# EAGLE design Qwiic-Cellular-Notepad (EAGLE 9.6.2)
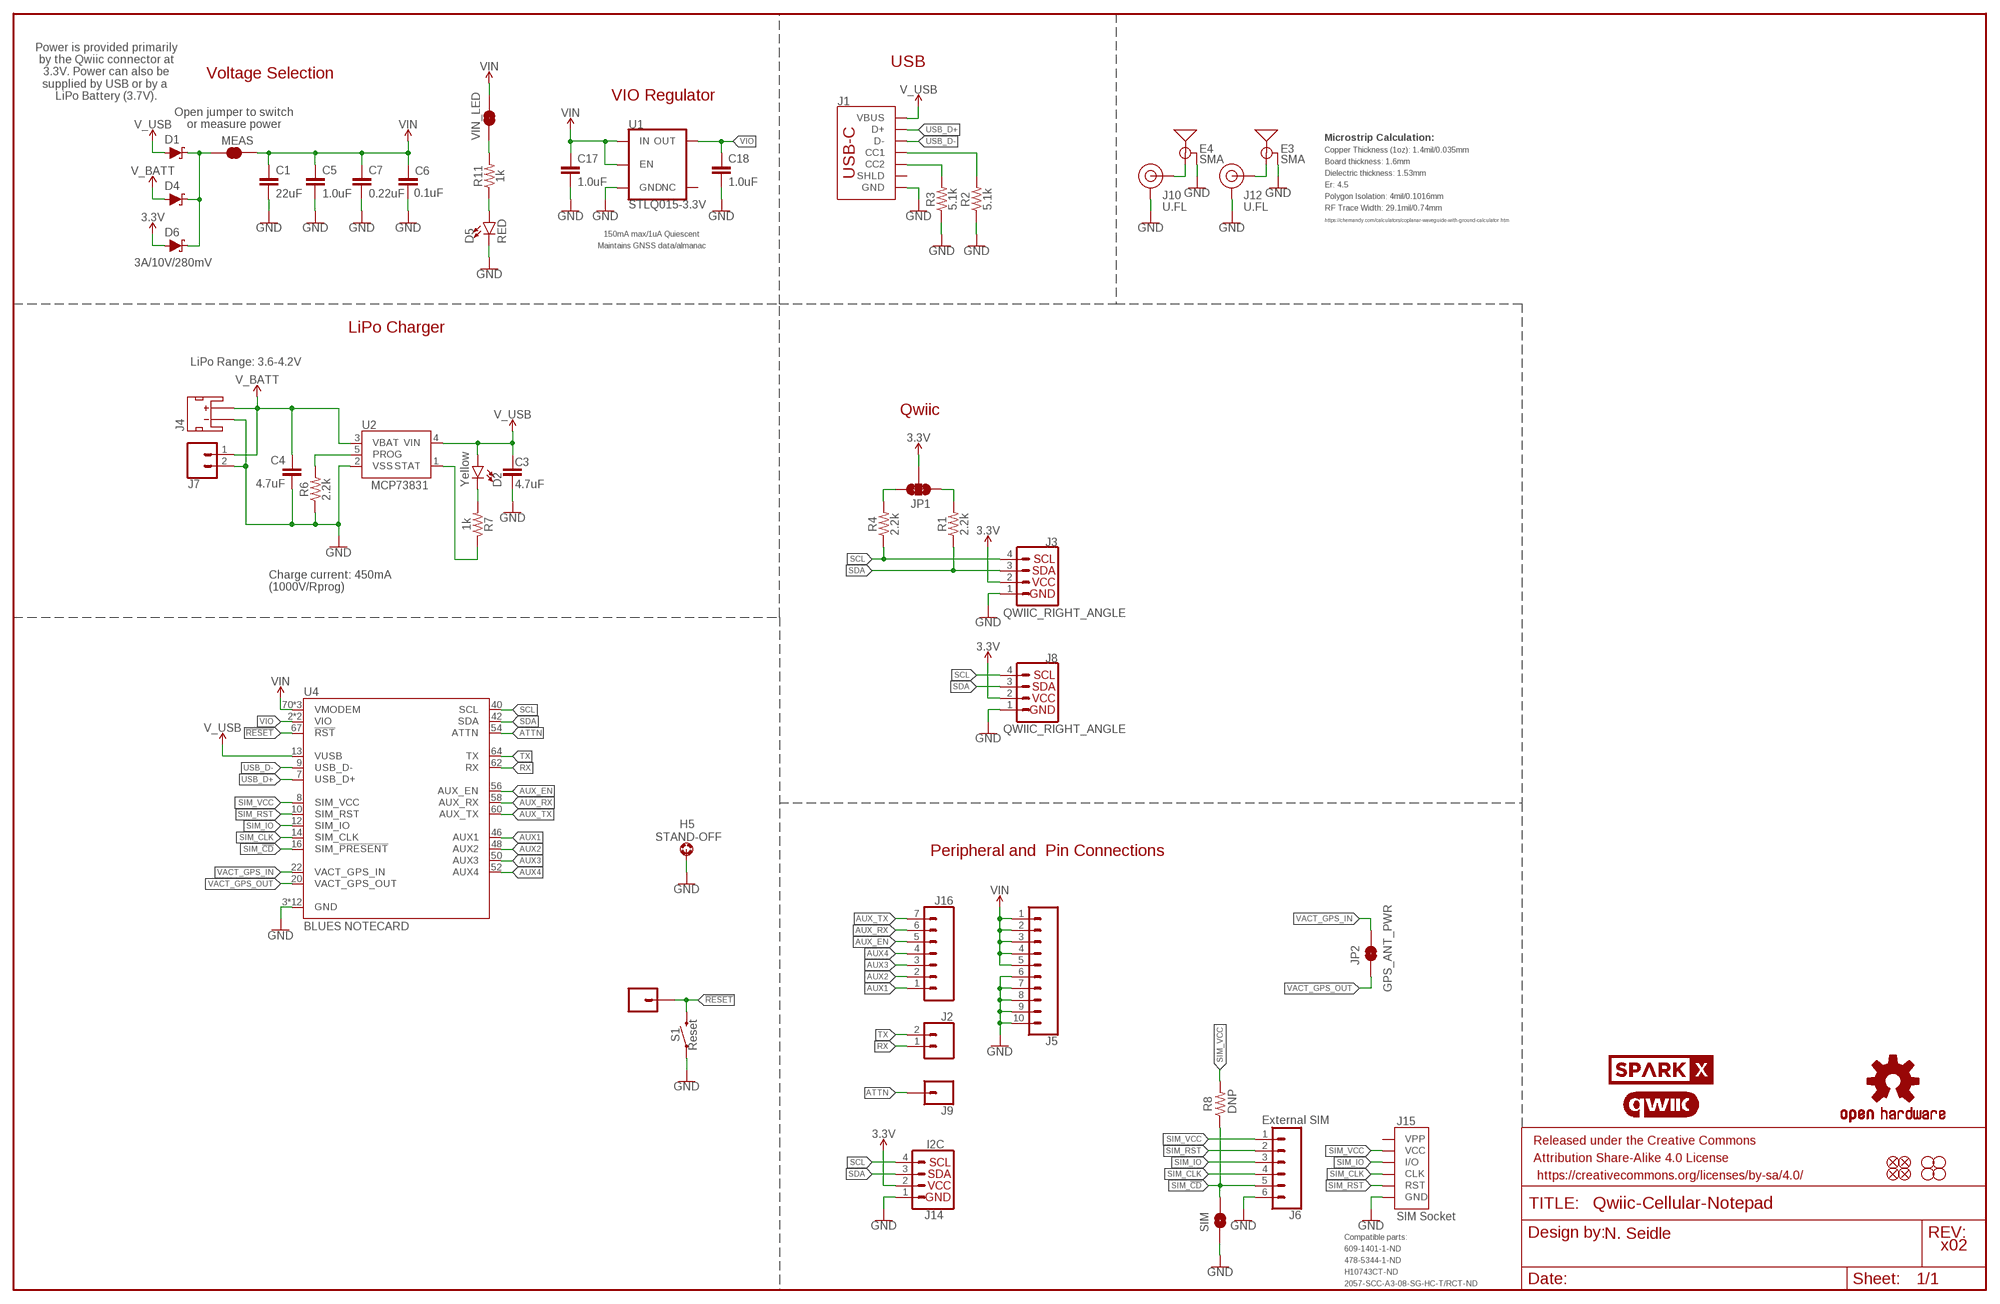
[diagram p0: schematic, sheet 1]

## Parts
C1  22uF  22UF-1210-16V-20%  [1210]
C3  4.7uF  4.7UF-0603-35V-(20%)  [0603]
C4  4.7uF  4.7UF-0603-6.3V-(10%)  [0603]
C5  1.0uF  1.0UF-0603-16V-10%  [0603]
C6  0.1uF  0.1UF-0603-25V-(+80/-20%)  [0603]
C7  0.22uF  0.22UF-0603-25V-10%  [0603]
C17  1.0uF  1.0UF-0603-16V-10%-X7R  [0603]
C18  1.0uF  1.0UF-0603-16V-10%-X7R  [0603]
D1  3A/10V/280mV  DIODE-SCHOTTKY-BAT60A  [SOD-323]
D2  Yellow  LED-YELLOW0603  [LED-0603]
D4  3A/10V/280mV  DIODE-SCHOTTKY-BAT60A  [SOD-323]
D5  RED  LED-RED0603  [LED-0603]
D6  3A/10V/280mV  DIODE-SCHOTTKY-BAT60A  [SOD-323]
E3  SMA  ANTENNA-SMA-GROUNDEDEDGE_SMA_SMD  [SMA-EDGE-SMD]
E4  SMA  ANTENNA-SMA-GROUNDEDEDGE_SMA_SMD  [SMA-EDGE-SMD]
FD1  FIDUCIALUFIDUCIAL  [FIDUCIAL-MICRO]
FD2  FIDUCIALUFIDUCIAL  [FIDUCIAL-MICRO]
FD3  FIDUCIALUFIDUCIAL  [FIDUCIAL-MICRO]
FD4  FIDUCIALUFIDUCIAL  [FIDUCIAL-MICRO]
FRAME1  FRAME-LEDGER  [CREATIVE_COMMONS]
H1  STAND-OFF  [STAND-OFF]
H2  STAND-OFF  [STAND-OFF]
H3  STAND-OFF  [STAND-OFF]
H4  STAND-OFF  [STAND-OFF]
H5  STAND-OFF  STAND-OFF-REFLOW2.5MM_TALL  [STAND-OFF-REFLOW-M2.5]
J1  USB_C_2-LAYER_PADS  [USB-C-16P-2LAYER-PADS]
J2  CONN_021X02_NO_SILK  [1X02_NO_SILK]
J3  QWIIC_RIGHT_ANGLE  QWIIC_CONNECTORJS-1MM  [JST04_1MM_RA]
J4  JST_2MM_MALE  [JST-2-SMD]
J5  CONN_10NO_SILK_PTH_FEMALE  [1X10_NO_SILK]
J6  External SIM  CONN_06NO_SILK_NO_POP  [1X06_NO_SILK]
J7  CONN_021X02_NO_SILK  [1X02_NO_SILK]
J8  QWIIC_RIGHT_ANGLE  QWIIC_CONNECTORJS-1MM  [JST04_1MM_RA]
J9  CONN_01PTH_NO_SILK_YES_STOP  [1X01_NO_SILK]
J10  U.FL  U.FL2PIN  [U.FL]
J12  U.FL  U.FL2PIN  [U.FL]
J13  CONN_01PTH_NO_SILK_YES_STOP  [1X01_NO_SILK]
J14  I2C  I2C_STANDARD_NO_SILK  [1X04_NO_SILK]
J15  SIM Socket  SIMHOLDER-SIM  [SIMHOLDER]
J16  CONN_07NO_SILK  [1X07_NO_SILK]
JP1  JUMPER-SMT_3_2-NC_TRACE_SILK  [SMT-JUMPER_3_2-NC_TRACE_SILK]
JP2  GPS_ANT_PWR  JUMPER-SMT_2_NO_SILK  [SMT-JUMPER_2_NO_SILK]
LOGO2  QWIIC_LOGO_CONNECTOR  [QWIIC_5.5MM]
LOGO3  OSHW-LOGOMINI  [OSHW-LOGO-MINI]
MEAS  JUMPER-COMBO_2_NC_TRACE  [COMBO-JUMPER_2_NC_TRACE]
R1  2.2k  2.2KOHM-0603-1/10W-1%  [0603]
R2  5.1k  5.1KOHM5.1KOHM-0603-1/10W-1%  [0603]
R3  5.1k  5.1KOHM5.1KOHM-0603-1/10W-1%  [0603]
R4  2.2k  2.2KOHM-0603-1/10W-1%  [0603]
R6  2.2k  2.2KOHM-0603-1/10W-1%  [0603]
R7  1k  1KOHM-0603-1/10W-1%  [0603]
R8  DNP  RESISTOR0603-RES  [0603-RES]
R11  1k  1KOHM-0603-1/10W-1%  [0603]
S1  Reset  MOMENTARY-SWITCH-SPST-SMD-5.2-TALL-REDUNDANT  [TACTILE_SWITCH_SMD_5.2MM]
SIM  JUMPER-SMT_2_NO_SILK  [SMT-JUMPER_2_NO_SILK]
U1  STLQ015-3.3V  [SOT23-5]
U2  MCP73831  [SOT23-5]
U4  BLUES NOTECARD  NOTECARD  [M.2-CONNECTOR-E]
U$56  SPARKX-LOGO4  [SPARKX-MEDIUM]
VIN_LED  JUMPER-SMT_2_NC_TRACE_SILK  [SMT-JUMPER_2_NC_TRACE_SILK]

## Nets
3.3V: D6.A J3.2 J8.2 J14.2 JP1.2
!RESET!: J13.1 S1.3 S1.4 U4.67(!RST!)
ATTN: J9.1 U4.54(ATTN)
AUX1: J16.1 U4.46(AUX1)
AUX2: J16.2 U4.48(AUX2)
AUX3: J16.3 U4.50(AUX3)
AUX4: J16.4 U4.52(AUX4)
AUX_EN: J16.5 U4.56(AUX_EN)
AUX_RX: J16.6 U4.58(AUX_RX)
AUX_TX: J16.7 U4.60(AUX_TX)
CHG_LED: R7.1 U2.1(STAT)
GND: C1.2 C3.2 C4.2 C5.2 C6.2 C7.2 C17.2 C18.2 D5.C E3.GND@0(GND) E3.GND@1(GND) E4.GND@0(GND) E4.GND@1(GND) H5.1 J1.GND J1.GND2(GND) J3.1 J4.1(-) J5.6 J5.7 J5.8 J5.9 J5.10 J6.6 J7.2 J8.1 J10.1(GND) J10.2(GND) J12.1(GND) J12.2(GND) J14.1 J15.C5(GND) R2.1 R3.1 R6.1 S1.1 S1.2 SIM.1 U1.2(GND) U2.2(VSS) U4.3(GND) U4.5(GND) U4.6(GND) U4.11(GND) U4.18(GND) U4.33(GND) U4.39(GND) U4.45(GND) U4.51(GND) U4.57(GND) U4.71(GND) U4.73(GND)
N$2: JP1.3 R4.2
N$3: JP1.1 R1.2
N$4: D2.C R7.2
N$5: D5.A R11.1
N$6: R11.2 VIN_LED.1
N$7: R6.2 U2.5(PROG)
N$10: J1.A5(CC1) R2.2
N$11: J1.B5(CC2) R3.2
RF_GPS: E4.SIG(SIGNAL) J10.FEED(SIGNAL)
RF_LTE: E3.SIG(SIGNAL) J12.FEED(SIGNAL)
RX: J2.1 U4.62(RX)
SCL: J3.4 J8.4 J14.4 R4.1 U4.40(SCL)
SDA: J3.3 J8.3 J14.3 R1.1 U4.42(SDA)
SIM_!CD!: J6.5 R8.1 SIM.2 U4.16(SIM_!PRESENT!)
SIM_CLK: J6.4 J15.C3(CLK) U4.14(SIM_CLK)
SIM_IO: J6.3 J15.C7(I/O) U4.12(SIM_IO)
SIM_RST: J6.2 J15.C2(RST) U4.10(SIM_RST)
SIM_VCC: J6.1 J15.C1(VCC) R8.2 U4.8(SIM_VCC)
TX: J2.2 U4.64(TX)
USB_D+: J1.A6(D+) J1.B6(D+) U4.7(USB_D+)
USB_D-: J1.A7(D-) J1.B7(D-) U4.9(USB_D-)
V_BATT: C4.1 D4.A J4.2(+) J7.1 U2.3(VBAT)
V_USB: C3.1 D1.A D2.A J1.VBUS1(VBUS) J1.VBUS2(VBUS) U2.4(VIN) U4.13(VUSB)
VACT_GPS_IN: JP2.2 U4.22(VACT_GPS_IN)
VACT_GPS_OUT: JP2.1 U4.20(VACT_GPS_OUT)
VIN: C1.1 C5.1 C6.1 C7.1 C17.1 J5.1 J5.2 J5.3 J5.4 J5.5 MEAS.2 MEAS.4 U1.1(IN) U1.3(EN) U4.70(VMODEM) U4.72(VMODEM) U4.74(VMODEM) VIN_LED.2
VIN1: D1.C D4.C D6.C MEAS.1 MEAS.3
VIO [power]: C18.1 U1.5(OUT) U4.2(VIO) U4.4(VIO)
Unconnected: J1.SHLD1(SHLD) J1.SHLD2(SHLD) J1.SHLD3(SHLD) J1.SHLD4(SHLD) J4.NC1(PAD1) J4.NC2(PAD2) J15.C6(VPP) U1.4(NC)

## Notes on the sheet
- USB
- Power is provided primarily
  by the Qwiic connector at
  3.3V. Power can also be
  supplied by USB or by a 
  LiPo Battery (3.7V).
- Voltage Selection
- VIO Regulator
- Open jumper to switch
  or measure power
- Microstrip Calculation:
- Copper Thickness (1oz): 1.4mil/0.035mm
- Board thickness: 1.6mm
- Dielectric thickness: 1.53mm
- Er: 4.5
- Polygon Isolation: 4mil/0.1016mm
- RF Trace Width: 29.1mil/0.74mm
- https://chemandy.com/calculators/coplanar-waveguide-with-ground-calculator.htm
- 150mA max/1uA Quiescent
- Maintains GNSS data/almanac
- LiPo Charger
- LiPo Range: 3.6-4.2V
- Qwiic
- Charge current: 450mA
  (1000V/Rprog)
- Peripheral and  Pin Connections
- Compatible parts: | N. Seidle
- 609-1401-1-ND | x02
- 478-5344-1-ND
- H10743CT-ND
- 2057-SCC-A3-08-SG-HC-T/RCT-ND

## Library data of the parts
C1 = SparkFun-Capacitors:22UF: 22µF ceramic capacitors A capacitor is a passive two-terminal electrical component used to store electrical energy temporarily in an electric field.; PROD_ID: CAP-10381
C3 = SparkFun-Capacitors:4.7UF: 4.7µF ceramic capacitors A capacitor is a passive two-terminal electrical component used to store electrical energy temporarily in an electric field.; PROD_ID: CAP-14106
C4 = SparkFun-Capacitors:4.7UF: 4.7µF ceramic capacitors A capacitor is a passive two-terminal electrical component used to store electrical energy temporarily in an electric field.; PROD_ID: CAP-08280
C5 = SparkFun-Capacitors:1.0UF: 1µF ceramic capacitors A capacitor is a passive two-terminal electrical component used to store electrical energy temporarily in an electric field.; PROD_ID: CAP-00868
C6 = SparkFun-Capacitors:0.1UF: 0.1µF ceramic capacitors A capacitor is a passive two-terminal electrical component used to store electrical energy temporarily in an electric field.; PROD_ID: CAP-00810
C7 = SparkFun-Capacitors:0.22UF: 0.22µF ceramic capacitors A capacitor is a passive two-terminal electrical component used to store electrical energy temporarily in an electric field.; PROD_ID: CAP-07822
C17 C18 = SparkFun-Capacitors:1.0UF: 1µF ceramic capacitors A capacitor is a passive two-terminal electrical component used to store electrical energy temporarily in an electric field.; PROD_ID: CAP-13930
D1 D4 D6 = SparkFun-DiscreteSemi:DIODE-SCHOTTKY: Schottky diode A Schottky diode is a semiconductor diode which has a low forward voltage drop and a very fast switching action.; PROD_ID: DIO-14072
D2 = SparkFun-LED:LED-YELLOW: Yellow SMD LED Used in manufacturing several products at SparkFun. Packages: 0603 - SMD 0603 package[Product Link] <http://www.kingbrightusa.com/product.asp?catalog_name=LED&product_id=APT1608SYCK> 0603 -SMART - SMART SMD 0603 package (more efficient/more expensive) [Product Link] <http://www.osram-os.com/osram_os/en/products/product-catalog/led-light-emitting-diodes/smartled-0603/ly-l29k/index.jsp> LilyPad - SMD1206 package[Product Datasheet] <https://www.sparkfun.com/datasheets/DevTools/LilyPad/Q150YUS4.pdf> SparkFun Products: Blynk Board <https://www.sparkfun.com/products/13794> IOIO-OTG <https://www.sparkfun.com/products/13613> XBee Explorer Serial <https://www.sparkfun.com/products/13225>; PROD_ID: DIO-09003
D5 = SparkFun-LED:LED-RED: Red SMD LED Used in manufacturing of most products at SparkFun Packages: 0603 - SMD 0603 package [Product Link] <http://docs.avagotech.com/docs/AV02-0551EN> 0603 SMART - SMD 0603 SMART package ( more efficient and expensive)[Product Link] <http://www.osram-os.com/Graphics/XPic2/00077099_0.pdf> 1206 - SMD1206 package [Product Link] <https://www.sparkfun.com/datasheets/DevTools/LilyPad/Q150OVS4.pdff> SparkFun Products: Pro Mini 328 -5V <https://www.sparkfun.com/products/821> RedBoard <https://www.sparkfun.com/products/12757> IOIO-OTG <https://www.sparkfun.com/products/13613>; PROD_ID: DIO-00819
E3 E4 = SparkFun-RF:ANTENNA-SMA-GROUNDED: SMA Antenna Connector w/ Ground Edge-mount and SMD SMA connectors for RF Antennas. **4-LAYER BOARD WARNING!!** When designing a 4-layer board using any of the SMD variants, you will need to manually add a cutout polygon on any internal power layers to make sure that you don't end up with exposed copper around the edge of the routed hole for these connectors. Exposed power copper could then short to the connector body - and that would be bad. Why hasn't anyone added the cutout polygons directly to the connector footprint? Well, your internal layers (usually 2 and 15) may be covered with GND polygons and you might well want the copper to go all the way to the edge, especially under the connector SIGNAL pin. So adding cutouts to the footprint might make matters worse, not better...; PROD_ID: CONN-15100
FD1-FD4 = SparkFun-Aesthetics:FIDUCIAL: Fiducial Alignment Points Point-of-reference for pick-and-place machines and other optical instruments.
FRAME1 = SparkFun-Aesthetics:FRAME-LEDGER: Schematic Frame - Ledger Standard 11x14 US Ledger frame
H1-H4 = SparkFun-Hardware:STAND-OFF: Stand Off Drill holes for mechanically mounting via screws, standoffs, etc. Note: Use the keepout ring to avoid running the screw head into surrounding components. Variant Overviews STAND-OFF - Mechanical footprint for a #4 phillips button head screw. STAND-OFF-TIGHT - Mechanical footprint for a #4 phillips button head screw, Example SparkFun Products Screw - Phillips Head (1/4", 4-40, 10 pack) <https://www.sparkfun.com/products/10453> (PRT-10453) Screw - Phillips Head (1/2", 4-40, 10 pack) <https://www.sparkfun.com/products/10452> (PRT-10452) Screw - Phillips Head (3/4", 4-40, 10 pack) <https://www.sparkfun.com/products/10451> (PRT-10451) Screw - Phillips Head (1", 4-40, 10 pack) <https://www.sparkfun.com/products/10450> (PRT-10450)
H5 = SparkFun-Hardware:STAND-OFF-REFLOW: Stand Off Reflow Compatible A metal standoff that can be placed and reflowed onto a PCB.; PROD_ID: HW-14899
J1 = SparkFun-Connectors:USB_C: USB Type C 16Pin Connector Super Speed pins not available on the 16-pin purely SMD connector so this part is best for USB 2.0 implementations. D1 and D2 are tied together enabling D+/- no matter which way the cable is plugged into the connector. The two channel configuration pins (CC1/2) are exposed. These are normally connected to ground via 5.1k resistors but can be reconfigured for high current/high power applications. **4-LAYER BOARD WARNING!!** If designing 4-layer board, make sure to select the variant _4-LAYER-ISOLATED. The linked footprint (USB-C-16-4LAYER-ISOLATED) includes some very necessary cutout polygons in the inner layers (2 and 15). This prevents the PTH mounting shield legs on the USB connector from electrically connecting any other polygons on the inner layers (usually VCC and GND).; PROD_ID: CONN-14122
J2 J7 = SparkFun-Connectors:CONN_02: Multi connection point. Often used as Generic Header-pin footprint for 0.1 inch spaced/style header connections On any of the 0.1 inch spaced packages, you can populate with these: Break Away Headers - Straight <https://www.sparkfun.com/products/116> (PRT-00116) Break Away Male Headers - Right Angle <https://www.sparkfun.com/products/553> (PRT-00553) Female Headers <https://www.sparkfun.com/products/115> (PRT-00115) Break Away Headers - Machine Pin <https://www.sparkfun.com/products/117> (PRT-00117) Break Away Female Headers - Swiss Machine Pin <https://www.sparkfun.com/products/743> (PRT-00743) For SCREWTERMINALS and SPRING TERMINALS visit here: Screw Terimnals on SparkFun.com <https://www.sparkfun.com/search/results?term=Screw+Terminals> (5mm/3.5mm/2.54mm spacing) This device is also useful as a general connection point to wire up your design to another part of your project. Our various solder wires solder well into these plated through hole pads. Hook-Up Wire - Assortment (Stranded, 22 AWG) <https://www.sparkfun.com/products/11375> (PRT-11375) Hook-Up Wire - Assortment (Solid Core, 22 AWG) <https://www.sparkfun.com/products/11367> (PRT-11367) View the entire wire category on our website here <https://www.sparkfun.com/categories/141> Special notes: Molex polarized connector foot print use with: PRT-08233 with associated crimp pins and housings. 2.54_SCREWTERM for use with PRT-10571. 3.5mm Screw Terminal footprints for PRT-08084 5mm Screw Terminal footprints for use with PRT-08432
J3 J8 = SparkFun-Connectors:QWIIC_CONNECTOR: SparkFun I2C Standard Qwiic Connector An SMD 1mm pitch JST connector makes it easy and quick (get it? Qwiic?) to connect I2C devices to each other. The Qwiic system <http://www.sparkfun.com/qwiic> enables fast and solderless connection between popular platforms and various sensors and actuators. We carry 200mm <https://www.sparkfun.com/products/14204>, 100mm <https://www.sparkfun.com/products/14205>, 50mm <https://www.sparkfun.com/products/14206>, and breadboard friendly <https://www.sparkfun.com/products/14207> Qwiic cables. We also offer 10 pcs strips <https://www.sparkfun.com/products/14323> the SMD connectors.; PROD_ID: CONN-13694
J4 = SparkFun-Connectors:JST_2MM_MALE: JST 2MM MALE RA CONNECTOR Two pin, compact surface mount connector. Commonly used as a battery input connection point. We really like the solid locking feeling and high current rating on these small connectors. We use these all the time as battery connectors. Mates to single-cell LiPo batteries. Here is the connector we sell at SparkFun: JST Right Angle Connector - White <https://www.sparkfun.com/products/8612> (PRT-08612) Datasheet <http://www.sparkfun.com/datasheets/Prototyping/Connectors/JST-Horizontal.pdf> It was used on these SparkFun products: SparkFun MOSFET Power Controller <https://www.sparkfun.com/products/11214> (PRT-11214) SparkFun Battery Babysitter - LiPo Battery Manager <https://www.sparkfun.com/products/13777> (PRT-13777) And many, many others that required a lipo battery connection.; PROD_ID: CONN-11443; SF_ID: PRT-08612
J5 = SparkFun-Connectors:CONN_10: Multi connection point. Often used as Generic Header-pin footprint for 0.1 inch spaced/style header connections On any of the 0.1 inch spaced packages, you can populate with these: Break Away Headers - Straight <https://www.sparkfun.com/products/116> (PRT-00116) Break Away Male Headers - Right Angle <https://www.sparkfun.com/products/553> (PRT-00553) Female Headers <https://www.sparkfun.com/products/115> (PRT-00115) Break Away Headers - Machine Pin <https://www.sparkfun.com/products/117> (PRT-00117) Break Away Female Headers - Swiss Machine Pin <https://www.sparkfun.com/products/743> (PRT-00743) Arduino Stackable Header - 10 Pin <https://www.sparkfun.com/products/11376> (PRT-11376) For SCREWTERMINALS and SPRING TERMINALS visit here: Screw Terimnals on SparkFun.com <https://www.sparkfun.com/search/results?term=Screw+Terminals> (5mm/3.5mm/2.54mm spacing) This device is also useful as a general connection point to wire up your design to another part of your project. Our various solder wires solder well into these plated through hole pads. Hook-Up Wire - Assortment (Stranded, 22 AWG) <https://www.sparkfun.com/products/11375> (PRT-11375) Hook-Up Wire - Assortment (Solid Core, 22 AWG) <https://www.sparkfun.com/products/11367> (PRT-11367) View the entire wire category on our website here <https://www.sparkfun.com/categories/141> Special notes: Molex polarized connector foot print use with SKU : PRT-08231 with associated crimp pins and housings. 1MM SMD Version SKU: PRT-10208 NOTES ON THE VARIANTS LOCK and LOCK_LONGPADS... This footprint was designed to help hold the alignment of a through-hole component (i.e. 6-pin header) while soldering it into place. You may notice that each hole has been shifted either up or down by 0.005 of an inch from it's more standard position (which is a perfectly straight line). This slight alteration caused the pins (the squares in the middle) to touch the edges of the holes. Because they are alternating, it causes a "brace" to hold the component in place. 0.005 has proven to be the perfect amount of "off-center" position when using our standard breakaway headers. Although looks a little odd when you look at the bare footprint, once you have a header in there, the alteration is very hard to notice. Also,if you push a header all the way into place, it is covered up entirely on the bottom side.
J6 = SparkFun-Connectors:CONN_06: Multi connection point. Often used as Generic Header-pin footprint for 0.1 inch spaced/style header connections On any of the 0.1 inch spaced packages, you can populate with these: Break Away Headers - Straight <https://www.sparkfun.com/products/116> (PRT-00116) Break Away Male Headers - Right Angle <https://www.sparkfun.com/products/553> (PRT-00553) Female Headers <https://www.sparkfun.com/products/115> (PRT-00115) Break Away Headers - Machine Pin <https://www.sparkfun.com/products/117> (PRT-00117) Break Away Female Headers - Swiss Machine Pin <https://www.sparkfun.com/products/743> (PRT-00743) Arduino Stackable Header - 6 Pin <https://www.sparkfun.com/products/9280> (PRT-09280) For SCREWTERMINALS and SPRING TERMINALS visit here: Screw Terimnals on SparkFun.com <https://www.sparkfun.com/search/results?term=Screw+Terminals> (5mm/3.5mm/2.54mm spacing) This device is also useful as a general connection point to wire up your design to another part of your project. Our various solder wires solder well into these plated through hole pads. Hook-Up Wire - Assortment (Stranded, 22 AWG) <https://www.sparkfun.com/products/11375> (PRT-11375) Hook-Up Wire - Assortment (Solid Core, 22 AWG) <https://www.sparkfun.com/products/11367> (PRT-11367) View the entire wire category on our website here <https://www.sparkfun.com/categories/141>
J9 J13 = SparkFun-Connectors:CONN_01: Single connection point. Often used as Generic Header-pin footprint for 0.1 inch spaced/style header connections On any of the 0.1 inch spaced packages, you can populate with these: Break Away Headers - Straight <https://www.sparkfun.com/products/116> (PRT-00116) Break Away Male Headers - Right Angle <https://www.sparkfun.com/products/553> (PRT-00553) Female Headers <https://www.sparkfun.com/products/115> (PRT-00115) Break Away Headers - Machine Pin <https://www.sparkfun.com/products/117> (PRT-00117) Break Away Female Headers - Swiss Machine Pin <https://www.sparkfun.com/products/743> (PRT-00743) This device is also useful as a general connection point to wire up your design to another part of your project. Our various solder wires solder well into these plated through hole pads. Hook-Up Wire - Assortment (Stranded, 22 AWG) <https://www.sparkfun.com/products/11375> (PRT-11375) Hook-Up Wire - Assortment (Solid Core, 22 AWG) <https://www.sparkfun.com/products/11367> (PRT-11367) View the entire wire category on our website here <https://www.sparkfun.com/categories/141> Special notes: SMTSO-256-ET is a "flush mount" nut for a 4-40 screw. We mostly use this on specialty testbeds; it is a nice way to connect hardware to your PCB at an adjustable hieght. Also note, the SNAP packages are for using a snappable style connector. We sell a baggie of snaps and they are also used on two LilyPad designs: Snap Assortment - 30 pack (male and female) <https://www.sparkfun.com/products/11347> (DEV-11347) LilyPad Arduino SimpleSnap <https://www.sparkfun.com/products/10941> (DEV-10941) LilyPad SimpleSnap Protoboard <https://www.sparkfun.com/products/10940> (DEV-10940)
J10 J12 = SparkFun-Connectors:U.FL2PIN: SMD Antenna Connector - U.FL 2mm height, 3.0mm x 3.0mm receptacle size. SparkFun Products: SparkFun WiFi Shield - ESP8266 <https://www.sparkfun.com/products/13287> SparkFun ESP8266 Thing <https://www.sparkfun.com/products/13231> SparkFun MiniGen - Pro Mini Signal Generator Shield <https://www.sparkfun.com/products/11420>; PROD_ID: CONN-09193; SF_ID: WRL-09144
J14 = SparkFun-Connectors:I2C_STANDARD: SparkFun I2C Standard Pinout Header SparkFun has standardized on a pinout for all I2C based sensor breakouts. This pinout allows I2C boards to be plugged directly into the headers on Arduino Uno compatible boards, and to be daisy chained easily. Example SparkFun Products: SparkFun Atmospheric Sensor Breakout - BME280 <https://www.sparkfun.com/products/13676> SparkFun Altitude/Pressure Sensor Breakout - MPL3115A2 <https://www.sparkfun.com/products/11084> SparkFun TOF Range Finder Sensor - VL6180 <https://www.sparkfun.com/products/12785>
J15 = SparkFun-Connectors:SIMHOLDER: SIM Cellular Card Socket SMT 6 pin standard connection. SparkFun Products: SIM Socket <https://www.sparkfun.com/products/548> SparkFun Cellular Shield - MG2639 <https://www.sparkfun.com/products/13120> SparkFun SIM Card Socket Breakout <https://www.sparkfun.com/products/573>; PROD_ID: CONN-08536; SF_ID: PRT-00548
J16 = SparkFun-Connectors:CONN_07: Multi connection point. Often used as Generic Header-pin footprint for 0.1 inch spaced/style header connections On any of the 0.1 inch spaced packages, you can populate with these: Break Away Headers - Straight <https://www.sparkfun.com/products/116> (PRT-00116) Break Away Male Headers - Right Angle <https://www.sparkfun.com/products/553> (PRT-00553) Female Headers <https://www.sparkfun.com/products/115> (PRT-00115) Break Away Headers - Machine Pin <https://www.sparkfun.com/products/117> (PRT-00117) Break Away Female Headers - Swiss Machine Pin <https://www.sparkfun.com/products/743> (PRT-00743) For SCREWTERMINALS and SPRING TERMINALS visit here: Screw Terimnals on SparkFun.com <https://www.sparkfun.com/search/results?term=Screw+Terminals> (5mm/3.5mm/2.54mm spacing) This device is also useful as a general connection point to wire up your design to another part of your project. Our various solder wires solder well into these plated through hole pads. Hook-Up Wire - Assortment (Stranded, 22 AWG) <https://www.sparkfun.com/products/11375> (PRT-11375) Hook-Up Wire - Assortment (Solid Core, 22 AWG) <https://www.sparkfun.com/products/11367> (PRT-11367) View the entire wire category on our website here <https://www.sparkfun.com/categories/141> Special notes: Molex polarized connector foot print use with SKU : PRT-08231 with associated crimp pins and housings. 1MM SMD Version SKU: PRT-10208 NOTES ON THE VARIANTS LOCK and LOCK_LONGPADS... This footprint was designed to help hold the alignment of a through-hole component (i.e. 6-pin header) while soldering it into place. You may notice that each hole has been shifted either up or down by 0.005 of an inch from it's more standard position (which is a perfectly straight line). This slight alteration caused the pins (the squares in the middle) to touch the edges of the holes. Because they are alternating, it causes a "brace" to hold the component in place. 0.005 has proven to be the perfect amount of "off-center" position when using our standard breakaway headers. Although looks a little odd when you look at the bare footprint, once you have a header in there, the alteration is very hard to notice. Also,if you push a header all the way into place, it is covered up entirely on the bottom side.
JP1 = SparkFun-Jumpers:JUMPER-SMT_3_2-NC_TRACE: Normally closed trace jumper (2 of 2 connections) This jumper has a trace between all three pads so they are normally closed (NC). Use a razor knife to open the connection(s). For best results follow the IPC guidelines for cutting traces: Cutout at least 0.063 mm (0.005 in). Remove all loose material to clean up the cut area. Seal the cut with an approved epoxy. Reapply solder to reclose the connection(s).
JP2 SIM = SparkFun-Jumpers:JUMPER-SMT_2_NO: Normally open jumper This jumper has two pads in close proximity to each other. Apply solder to close the connection. Round pads are easier to solder for beginners, but are a lot larger. SparkFun Product that uses the round pads: SparkFun EL Sequencer <https://www.sparkfun.com/products/12781>
LOGO2 = SparkFun-Aesthetics:QWIIC_LOGO: Qwiic Logos for placement on schematic and PCB. The 5.5mm silk logo is best for placing next to Qwiic connector.
LOGO3 = SparkFun-Aesthetics:OSHW-LOGO: Open-Source Hardware (OSHW) Logo This logo indicates the piece of hardware it is found on incorporates a OSHW license and/or adheres to the definition of open source hardware found here: http://freedomdefined.org/OSHW
MEAS = SparkFun-Jumpers:JUMPER-COMBO_2_NC_TRACE
R1 R4 R6 = SparkFun-Resistors:2.2KOHM: 2.2kΩ resistor A resistor is a passive two-terminal electrical component that implements electrical resistance as a circuit element. Resistors act to reduce current flow, and, at the same time, act to lower voltage levels within circuits. - Wikipedia; PROD_ID: RES-08272
R2 R3 = SparkFun-Resistors:5.1KOHM; PROD_ID: RES-12083
R7 R11 = SparkFun-Resistors:1KOHM: 1kΩ resistor A resistor is a passive two-terminal electrical component that implements electrical resistance as a circuit element. Resistors act to reduce current flow, and, at the same time, act to lower voltage levels within circuits. - Wikipedia; PROD_ID: RES-07856
R8 = Testing:RESISTOR: Resistor Basic schematic elements and footprints for 0603, 1206, and PTH resistors.
S1 = SparkFun-Switches:MOMENTARY-SWITCH-SPST: Momentary Switch (Pushbutton) - SPST Normally-open (NO) SPST momentary switches (buttons, pushbuttons). Variants PTH-12MM - 12mm square, through-hole Momentary Pushbutton Switch - 12mm Square <https://www.sparkfun.com/products/9190> (COM-09190) PTH-6.0MM, PTH-6.0MM-KIT - 6.0mm square, through-hole Mini Pushbutton Switch <https://www.sparkfun.com/products/97> (COM-00097) KIT package intended for soldering kit's - only one side of pads' copper is exposed. PTH-RIGHT-ANGLE-KIT - Right-angle, through-hole Right Angle Tactile Button <https://www.sparkfun.com/products/10791> - Used on SparkFun BigTime Watch Kit <https://www.sparkfun.com/products/11734> SMD-12MM - 12mm square, surface-mount Tactile Button - SMD (12mm) <https://www.sparkfun.com/products/12993> (COM-12993) Used on SparkFun PicoBoard <https://www.sparkfun.com/products/11888> SMD-4.5MM - 4.5mm Square Trackball Switch Used on SparkFun Blackberry Trackballer Breakout <https://www.sparkfun.com/products/13169> SMD-4.6MMX2.8MM - 4.60mm x 2.80mm, surface mount Used on SparkFun Pro Micro - RP2040 <https://www.sparkfun.com/products/17717> SMD-5.2MM, SMD-5.2-REDUNDANT - 5.2mm square, surface-mount Mini Pushbutton Switch - SMD <https://www.sparkfun.com/products/8720> (COM-08720) Used on Arduino Pro Mini <https://www.sparkfun.com/products/11114> REDUNDANT package connects both switch circuits together SMD-6.0X3.5MM - 6.0 x 3.5mm, surface mount Momentary Reset Switch SMD <https://www.sparkfun.com/products/8229> (COM-08229) SMD-6.2MM-TALL - 6.2mm square, surface mount Tactile Button - SMD (6mm) <https://www.sparkfun.com/products/12992> Used on SparkFun Digital Sandbox <https://www.sparkfun.com/products/12651> SMD-RIGHT-ANGLE - Right-angle, surface mount Used on SparkFun Block for Intel® Edison - Arduino <https://www.sparkfun.com/products/13036>; PROD_ID: SWCH-14139
U1 = SparkFun-IC-Power:STLQ015: STLQ015 - 150mA CMOS LDO Regulator w/ Enable 1.4uA quiescent; PROD_ID: IC-15779
U2 = SparkFun-IC-Power:MCP73831: MCP73831T Li-Ion, Li-Pol Controller Miniature single cell, fully integrated Li-Ion, Li-polymer charge management controller Datasheet <http://ww1.microchip.com/downloads/en/DeviceDoc/20001984g.pdf> SparkFun Products: SparkFun ESP32 Thing <https://www.sparkfun.com/products/13907> SparkFun 9DoF Razor IMU M0 <https://www.sparkfun.com/products/14001>; PROD_ID: IC-09995
U4 = Notecard:NOTECARD
U$56 = SparkX:SPARKX-LOGO
VIN_LED = SparkFun-Jumpers:JUMPER-SMT_2_NC_TRACE: Normally closed trace jumper This jumper has a trace between two pads so it's normally closed (NC). Use a razor knife to open the connection. For best results follow the IPC guidelines for cutting traces: Cutout at least 0.063 mm (0.005 in). Remove all loose material to clean up the cut area. Seal the cut with an approved epoxy. Reapply solder to reclose the connection.

## Net classes
1 power: width 0.305 mm

## Board
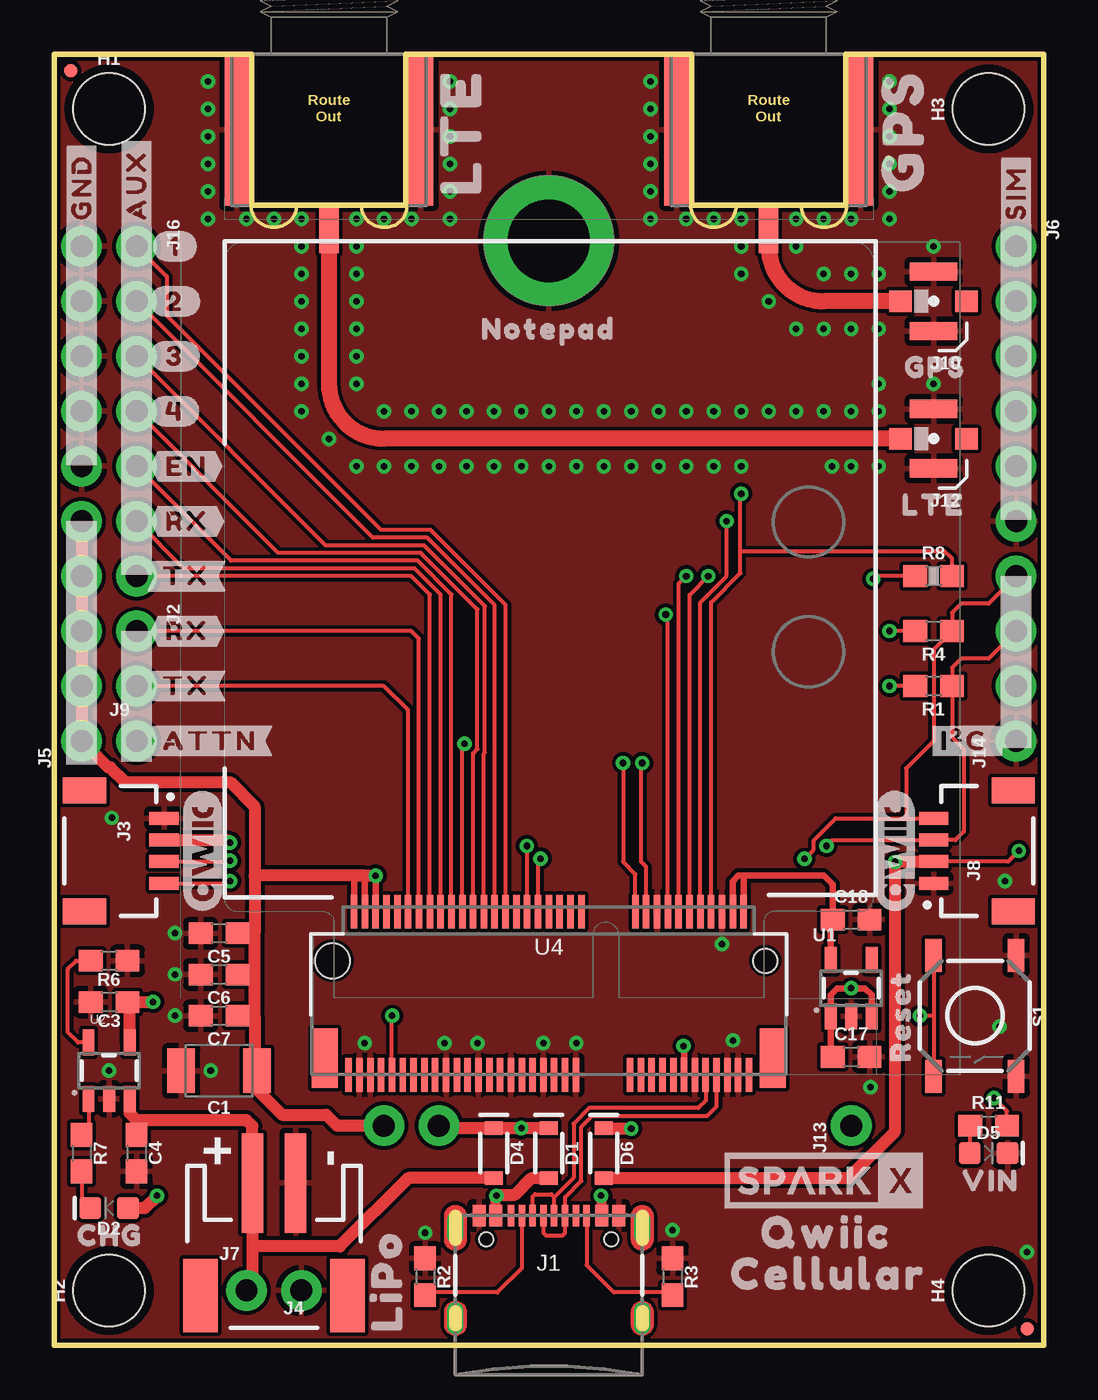
[diagram p1: board, top side]
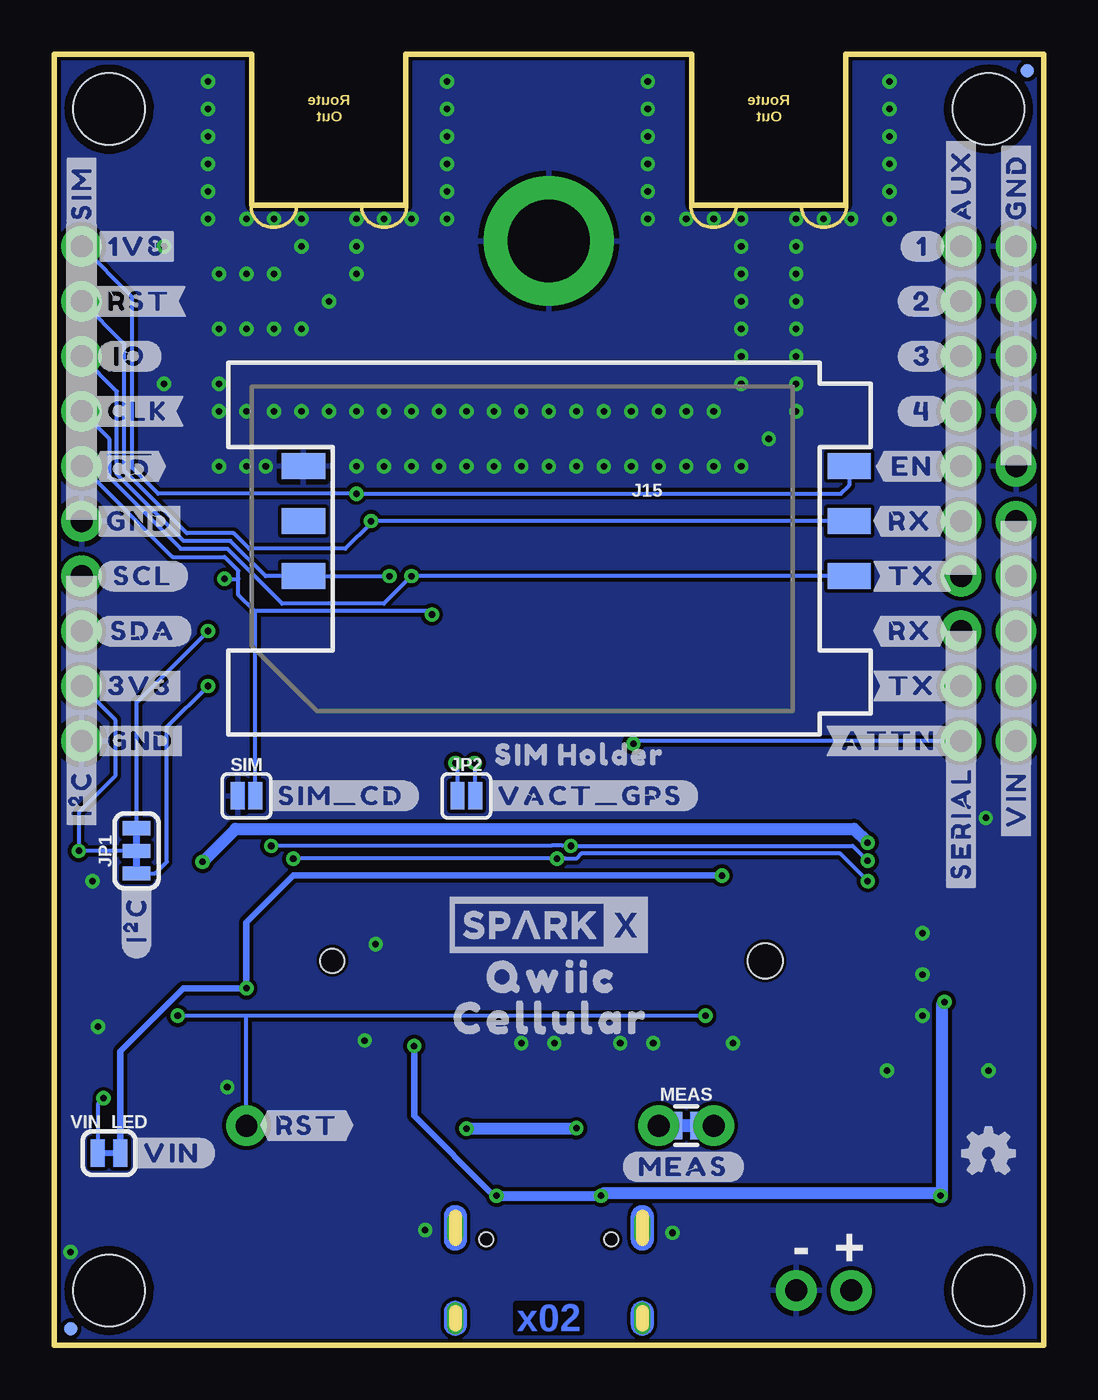
[diagram p2: board, bottom side, seen from below]

Size 45.72 x 59.69 mm. Coordinates in mm from the lower left corner, seen from the top.
Outline: 45.72,0 0,0 0,59.69 9.14,59.69 9.14,52.7 16.26,52.7 16.26,59.69 29.46,59.69 29.46,52.7 36.58,52.7 36.58,59.69 45.72,59.69 45.72,0
Copper layers (1*16): Top 0.035mm / dielectric 1.5mm / Bottom 0.035mm
Design rules "SparkFun-2-layer-TIGHT *": minimum track width 7mil, minimum drill 12mil, track to track 7mil, track to pad 7mil, pad to pad 7mil, via to via 7mil, smd to smd 7mil, copper to edge 7mil, drill to drill 7mil, minimum pad ring 7mil, minimum via ring 7mil, stop-mask expansion 4mil, vias tented up to drill 25mil, thermal gap 10mil

### Footprints (pad centres in the part's own frame; a part is rotated, then mirrored left to right if it is on the bottom)
1210 = smd 1.27 x 2.06: 1 -1.755,0; 2 1.755,0
0603 = smd 1.1 x 1: 1 -0.85,0; 2 0.85,0
SOD-323 = smd 0.63 x 0.83: A 1.15,0; C -1.15,0
LED-0603 = smd 1 x 1: A -0.877,0; C 0.877,0
SMA-EDGE-SMD = smd 1.15 x 7: GND@0 -4.25,-3.5; GND@1 4.25,-3.5 | smd 0.9 x 2.2: SIG 0,-8.1
FIDUCIAL-MICRO = smd 0.635 x 0.635: 1 0,0
STAND-OFF = hole 3.302: 0,0
STAND-OFF-REFLOW-M2.5 = drill 3.8 pad 6: 1 0,0
USB-C-16P-2LAYER-PADS = smd 0.3 x 1: A5 -1.25,-0.34; A6 -0.25,-0.34; A7 0.25,-0.34; A8 1.25,-0.34; B5 1.75,-0.34; B6 0.75,-0.34; B7 -0.75,-0.34; B8 -1.75,-0.34 | smd 0.6 x 1: GND -3.225,-0.34; GND2 3.225,-0.34; VBUS1 -2.45,-0.34; VBUS2 2.45,-0.34 | drill 0.4 pad 0.6 long: SHLD1 -4.318,-0.915; SHLD2 4.318,-0.915; SHLD3 -4.318,-5.095; SHLD4 4.318,-5.095 | hole 0.65: -2.89,-1.445; 2.89,-1.445
1X02_NO_SILK = drill 1.016 pad 1.88: 1 0,0; 2 2.54,0
JST04_1MM_RA = smd 0.6 x 1.35: 1 -1.5,0; 2 -0.5,0; 3 0.5,0; 4 1.5,0 | smd 1.2 x 2: NC1 2.8,-3.675; NC2 -2.8,-3.675
JST-2-SMD = smd 1 x 4.6: 1 -1,-3.7; 2 1,-3.7 | smd 1.6 x 3.4: NC1 -3.4,1.5; NC2 3.4,1.5
1X10_NO_SILK = drill 1.016 pad 1.88: 1 0,0; 2 2.54,0; 3 5.08,0; 4 7.62,0; 5 10.16,0; 6 12.7,0; 7 15.24,0; 8 17.78,0; 9 20.32,0; 10 22.86,0
1X06_NO_SILK = drill 1.016 pad 1.88: 1 0,0; 2 2.54,0; 3 5.08,0; 4 7.62,0; 5 10.16,0; 6 12.7,0
1X01_NO_SILK = drill 1.016 pad 1.88: 1 0,0
U.FL = smd 2.2 x 0.85: 1 0,1.375; 2 0,-1.375 | smd 1.05 x 1: FEED 1.525,0; NC -1.525,0
1X04_NO_SILK = drill 1.016 pad 1.88: 1 0,0; 2 2.54,0; 3 5.08,0; 4 7.62,0
SIMHOLDER = smd 2 x 1.2: C1 -12.61,-3.81; C2 -12.61,-1.27; C3 -12.61,1.27; C5 12.61,-3.81; C6 12.61,-1.27; C7 12.61,1.27
1X07_NO_SILK = drill 1.016 pad 1.88: 1 0,0; 2 2.54,0; 3 5.08,0; 4 7.62,0; 5 10.16,0; 6 12.7,0; 7 15.24,0
SMT-JUMPER_3_2-NC_TRACE_SILK = smd 0.66 x 1.27: 1 -1.041,0; 2 0,0; 3 1.041,0
SMT-JUMPER_2_NO_SILK = smd 0.635 x 1.27: 1 -0.406,0; 2 0.406,0
COMBO-JUMPER_2_NC_TRACE = smd 0.635 x 1.27: 1 -0.508,0; 2 0.508,0 | drill 1.016 pad 1.88: 3 -1.27,0; 4 1.27,0
0603-RES = smd 1.1 x 1: 1 -0.85,0; 2 0.85,0
TACTILE_SWITCH_SMD_5.2MM = smd 1.524 x 0.762: 1 -2.794,1.905; 2 2.794,1.905; 3 -2.794,-1.905; 4 2.794,-1.905
SOT23-5 = smd 0.55 x 1.2: 1 -0.95,-1.3; 2 0,-1.3; 3 0.95,-1.3; 4 0.95,1.3; 5 -0.95,1.3
M.2-CONNECTOR-E = smd 0.3 x 1.55: 1 9.25,-5.275; 2 9,2.275; 3 8.75,-5.275; 4 8.5,2.275; 5 8.25,-5.275; 6 8,2.275; 7 7.75,-5.275; 8 7.5,2.275; 9 7.25,-5.275; 10 7,2.275; 11 6.75,-5.275; 12 6.5,2.275; 13 6.25,-5.275; 14 6,2.275; 15 5.75,-5.275; 16 5.5,2.275; 17 5.25,-5.275; 18 5,2.275; 19 4.75,-5.275; 20 4.5,2.275; 21 4.25,-5.275; 22 4,2.275; 23 3.75,-5.275; 32 1.5,2.275; 33 1.25,-5.275; 34 1,2.275; 35 0.75,-5.275; 36 0.5,2.275; 37 0.25,-5.275; 38 0,2.275; 39 -0.25,-5.275; 40 -0.5,2.275; 41 -0.75,-5.275; 42 -1,2.275; 43 -1.25,-5.275; 44 -1.5,2.275; 45 -1.75,-5.275; 46 -2,2.275; 47 -2.25,-5.275; 48 -2.5,2.275; 49 -2.75,-5.275; 50 -3,2.275; 51 -3.25,-5.275; 52 -3.5,2.275; 53 -3.75,-5.275; 54 -4,2.275; 55 -4.25,-5.275; 56 -4.5,2.275; 57 -4.75,-5.275; 58 -5,2.275; 59 -5.25,-5.275; 60 -5.5,2.275; 61 -5.75,-5.275; 62 -6,2.275; 63 -6.25,-5.275; 64 -6.5,2.275; 65 -6.75,-5.275; 66 -7,2.275; 67 -7.25,-5.275; 68 -7.5,2.275; 69 -7.75,-5.275; 70 -8,2.275; 71 -8.25,-5.275; 72 -8.5,2.275; 73 -8.75,-5.275; 74 -9,2.275; 75 -9.25,-5.275 | smd 1.2 x 2.75: A1 10.35,-4.5; A2 -10.35,-4.5 | hole 1.1: 10,0 | hole 1.6: -10,0
SMT-JUMPER_2_NC_TRACE_SILK = smd 0.66 x 1.27: 1 -0.521,0; 2 0.521,0

### Placement (x,y rotation side)
C1  7.62,12.7 180 top
C3  2.54,15.88 180 top
C4  3.81,8.89 270 top
C5  7.62,19.05 180 top
C6  7.62,17.14 180 top
C7  7.62,15.24 180 top
C17  36.83,13.34 0 top
C18  36.83,19.68 0 top
D1  22.86,8.89 270 top
D2  2.54,6.35 180 top
D4  20.32,8.89 270 top
D5  43.18,8.89 0 top
D6  25.4,8.89 270 top
E3  12.7,59.69 0 top
E4  33.02,59.69 0 top
FD1  44.96,0.76 90 top
FD2  0.76,58.93 90 top
FD3  44.96,0.76 270 bottom
FD4  0.76,58.93 270 bottom
FRAME1  1.27,-24.13 0 top  (outside the outline)
H1  2.54,57.15 0 top
H2  2.54,2.54 90 top
H3  43.18,57.15 90 top
H4  43.18,2.54 90 top
H5  22.86,51.05 0 top
J1  22.86,6.35 0 top
J2  3.81,33.02 270 top
J3  5.08,22.86 270 top
J4  10.16,3.81 180 top
J5  1.27,27.94 90 top
J6  44.45,50.8 270 top
J7  8.89,2.54 0 top
J8  40.64,22.86 90 top
J9  3.81,27.94 0 top
J10  40.64,48.26 180 top
J12  40.64,41.91 180 top
J13  36.83,10.16 90 top
J14  44.45,27.94 90 top
J15  21.59,36.83 180 bottom
J16  3.81,50.8 270 top
JP1  41.91,22.86 90 bottom
JP2  26.67,25.4 0 bottom
LOGO2  38.86,22.86 90 top
LOGO3  2.54,8.89 0 bottom
LOGO5  QWIIC_LOGO_CONNECTOR  [QWIIC_5.5MM]  6.86,22.86 90 top
MEAS  16.51,10.16 0 bottom
R1  40.64,30.48 180 top
R2  17.14,3.17 270 top
R3  28.57,3.17 270 top
R4  40.64,33.02 180 top
R6  2.54,17.78 180 top
R7  1.27,8.89 270 top
R8  40.64,35.56 0 top
R11  43.18,10.16 0 top
S1  42.55,15.24 270 top
SIM  36.83,25.4 0 bottom
U1  36.83,16.51 0 top
U2  2.54,12.7 0 top
U4  22.86,17.78 0 top
U$1  [#1#1]  6.6,50.8 0 bottom
U$2  [#3V3#2]  43.94,30.48 0 bottom
U$3  [#GND#0]  44.01,38.1 0 bottom
U$4  [#2#2]  6.73,48.26 0 bottom
U$5  [#3#3]  6.73,45.72 0 bottom
U$6  [#4#4]  6.73,43.18 0 bottom
U$7  [GPS_0]  39.24,51.94 90 top
U$8  [#SERIAL#1]  3.81,20.83 90 bottom
U$9  [#I�C_#0]  44.45,23.75 90 bottom
U$10  [#I�C#0]  41.91,17.91 90 bottom
U$11  [#AUX#0]  3.81,51.31 90 bottom
U$12  [LTE_1]  18.8,51.82 90 top
U$13  [#GND#3]  43.94,27.94 0 bottom
U$14  [#RX#6]  7.87,38.1 0 bottom
U$15  [LIPO0]  15.37,-0.38 90 top
U$16  [#TX#5]  7.87,35.56 0 bottom
U$17  [#SCL#1]  43.69,35.56 0 bottom
U$18  [#GND#0]  1.27,51.31 90 bottom
U$19  [#EN#0]  7.75,40.64 0 bottom
U$20  [NOTEPAD0]  19.05,46.99 0 top
U$21  [#SDA#0]  43.81,33.02 0 bottom
U$22  [#GND#0]  1.27,51.31 90 top
U$23  [#VIN#0]  1.27,23.24 90 bottom
U$24  [#VACT_GPS#0]  25.91,25.4 0 bottom
U$25  [#SIM_CD#0]  36.07,25.4 0 bottom
U$26  [QWIIC0]  26.8,17.02 0 bottom
U$27  [SIM_HOLDER0]  26.04,27.3 0 bottom
U$28  [#MEAS#3]  19.43,8.26 0 bottom
U$29  [CELLULAR1]  30.23,3.3 0 top
U$30  [#RST#0]  36.2,10.16 0 bottom
U$31  [QWIIC0]  31.62,5.21 0 top
U$32  [CELLULAR1]  28.32,15.11 0 bottom
U$33  [#VIN#1]  42.29,8.89 0 bottom
U$34  [##CD##1]  43.94,40.64 0 bottom
U$35  [#1V8#4]  43.94,50.8 0 bottom
U$36  [#CLK#3]  43.94,43.18 0 bottom
U$37  [#IO#2]  43.69,45.72 0 bottom
U$38  [#RST#5]  43.94,48.26 0 bottom
U$39  [#SIM#0]  44.45,51.31 90 bottom
U$40  [#AUX#0]  3.81,51.31 90 top
U$41  [#1#1]  4.57,50.8 0 top
U$42  [#2#2]  4.45,48.26 0 top
U$43  [#3#3]  4.45,45.72 0 top
U$44  [#4#4]  4.45,43.18 0 top
U$45  [#EN#0]  4.45,40.64 0 top
U$46  [#RX#6]  4.45,38.1 0 top
U$47  [#TX#5]  4.32,35.56 0 top
U$48  [#RX#0]  4.45,33.02 0 top
U$49  [#TX#1]  4.32,30.48 0 top
U$50  [#ATTN#2]  4.32,27.94 0 top
U$51  [#SIM#0]  44.45,51.31 90 top
U$52  [#RX#0]  7.87,33.02 0 bottom
U$53  [#I�C_#0]  40.26,27.94 0 top
U$54  [#TX#1]  7.87,30.48 0 bottom
U$55  [#ATTN#2]  10.03,27.94 0 bottom
U$56  35.56,7.62 0 top
U$57  SPARKX-LOGO4  [SPARKX-MEDIUM]  22.86,19.43 0 bottom
U$58  [GPS0]  38.61,45.21 0 top
U$59  [LTE1]  38.48,38.86 0 top
U$92  [RESET1]  39.12,12.45 90 top
U$94  [VIN1]  41.27,7.62 0 top
U$96  [CHG1]  0.38,5.08 0 top
VIN_LED  43.18,8.89 0 bottom

### Tracks (layer width: path | path; a pad name or v marks a point on that pad's centre or on a via)
3.3V  (via drill 0.3)
  Top 0.178: v44.58,22.86 44.08,22.36 J8.2
  Top 0.559: J3.2 8.01,23.36 v8.13,23.24 | J8.2 v38.87,22.36 v38.86,22.35 38.86,9.91 36.7,7.74 D6.A
  Bottom 0.178: JP1.2 v44.58,22.86 44.58,24.64 42.9,26.31 42.9,28.93 J14.2
  Bottom 0.559: v8.13,23.24 8.76,23.88 37.34,23.88 v38.86,22.35
!RESET!  (via drill 0.3)
  Top 0.178: S1.3 40.64,15.24 | 40.64,15.24 S1.4 | U4.67 15.61,15.23 v15.62,15.24 | 40.64,15.24 v40.01,15.24
  Bottom 0.178: v15.62,15.24 36.83,15.24 | 36.83,15.24 v40.01,15.24 | J13.1 36.83,15.24
ATTN  (via drill 0.3)
  Top 0.178: U4.54 18.86,27.72 v18.96,27.81
  Bottom 0.178: J9.1 18.83,27.94 v18.96,27.81
AUX1
  Top 0.178: J16.1 5.21,49.4 5.21,47.6 15.11,37.69 17.39,37.69 20.86,34.23 U4.46
AUX2
  Top 0.178: J16.2 14.73,37.34 17.25,37.34 20.36,34.22 U4.48
AUX3
  Top 0.178: J16.3 12.55,36.98 17.1,36.98 19.91,34.17 19.91,27.42 19.86,27.37 U4.50
AUX4
  Top 0.178: J16.4 10.36,36.63 16.95,36.63 19.55,34.02 19.55,27.57 19.36,27.37 U4.52
AUX_EN
  Top 0.178: U4.56 18.36,34.72 16.8,36.27 8.18,36.27 J16.5
AUX_RX
  Top 0.178: U4.58 17.86,34.71 16.66,35.92 5.99,35.92 J16.6
AUX_TX
  Top 0.178: U4.60 17.36,34.71 16.51,35.56 J16.7
CHG_LED
  Top 0.178: U2.1 1.59,10.06 R7.1
GND  (via drill 0.3)
  other vias: 2.54,12.7 7.24,12.7 5.59,15.24 5.59,17.14 5.59,19.05 2.67,24.38 43.94,21.46 43.69,14.73 31.37,14.1 19.56,13.97 22.61,13.97 24.13,13.97 18.03,13.97 14.35,13.97 30.86,18.54 17.14,5.21 28.57,5.33 44.96,4.32 27.56,58.42 27.56,57.15 27.56,55.88 27.56,54.61 27.56,53.34 27.56,52.07 35.94,40.64 29.21,52.07 30.48,52.07 31.75,52.07 34.29,52.07 35.56,52.07 36.83,52.07 38.61,52.07 38.61,53.34 38.61,54.61 38.61,55.88 38.61,57.15 38.61,58.42 18.29,58.42 18.29,57.15 18.29,55.88 18.29,54.61 18.29,53.34 18.29,52.07 16.51,52.07 15.24,52.07 13.97,52.07 11.43,52.07 10.16,52.07 8.89,52.07 7.11,52.07 7.11,53.34 7.11,54.61 7.11,55.88 7.11,57.15 7.11,58.42 11.43,50.8 11.43,49.53 11.43,48.26 11.43,46.99 11.43,45.72 11.43,44.45 11.43,43.18 12.7,41.91 13.97,40.64 15.24,40.64 16.51,40.64 17.78,40.64 19.05,40.64 20.32,40.64 21.59,40.64 22.86,40.64 24.13,40.64 25.4,40.64 26.67,40.64 27.94,40.64 29.21,40.64 30.48,40.64 31.75,40.64 36.83,40.64 38.1,40.64 13.97,44.45 15.24,43.18 16.51,43.18 17.78,43.18 19.05,43.18 20.32,43.18 21.59,43.18 22.86,43.18 24.13,43.18 25.4,43.18 26.67,43.18 27.94,43.18 29.21,43.18 30.48,43.18 31.75,43.18 13.97,50.8 13.97,49.53 13.97,48.26 13.97,46.99 13.97,45.72 33.02,43.18 34.29,43.18 35.56,43.18 36.83,43.18 38.1,43.18 40.64,44.45 38.1,44.45 31.75,50.8 31.75,49.53 33.02,48.26 34.29,46.99 35.56,46.99 36.83,46.99 38.1,46.99 38.1,49.53 36.83,49.53 35.56,49.53 34.29,50.8 40.64,50.8 37.72,11.94
  pour Bottom (isolate 0.102): 0,0 0,59.69 45.72,59.69 45.72,0
  pour Top (isolate 0.102): 0,0 0,59.69 45.72,59.69 45.72,0
N$2  (via drill 0.3)
  Top 0.178: R4.2 v38.61,33.02
  Bottom 0.178: JP1.3 41.91,29.72 v38.61,33.02
N$3  (via drill 0.3)
  Top 0.178: R1.2 v38.61,30.48
  Bottom 0.178: JP1.1 41.05,21.82 40.51,22.35 40.51,28.57 v38.61,30.48
N$4
  Top 0.178: R7.2 1.27,6.74 D2.C
N$5
  Top 0.178: R11.1 42.3,10.13 D5.A
N$6  (via drill 0.3)
  Top 0.178: R11.2 44.03,10.83 v43.43,11.43
  Bottom 0.178: v43.43,11.43 43.7,11.16 VIN_LED.1
N$7
  Top 0.178: U2.5 1.11,14 0.64,14.48 0.64,17.4 1.02,17.78 R6.2
N$10
  Top 0.178: J1.A5 21.61,3.58 20.49,2.45 17.27,2.45 R2.2
N$11
  Top 0.178: R3.2 28.45,2.45 25.87,2.45 24.61,3.71 J1.B5
RF_GPS
  Top 0.739: J10.FEED 35.56,48.26 arc-90 33.02,50.8 E4.SIG
RF_LTE
  Top 0.739: J12.FEED 15.24,41.91 arc-90 12.7,44.45 E3.SIG
RX
  Top 0.178: U4.62 16.86,32.67 16.51,33.02 J2.1
SCL  (via drill 0.3)
  Top 0.178: J3.4 8.03,21.36 v8.13,21.46 | U4.40 22.36,22.38 v22.48,22.5 | v34.67,22.49 35.09,22.91 35.09,23.34 36.11,24.36 39.37,24.36 | 39.37,24.36 J8.4 | J14.4 43.18,34.29 41.91,34.29 41.49,33.87 R4.1 40.64,32.17 40.64,27.94 39.37,26.67 39.37,24.36
  Bottom 0.178: v8.13,21.46 9.4,22.73 21.36,22.73 21.6,22.49 22.09,22.49 22.1,22.5 v22.48,22.5 34.66,22.5 v34.67,22.49
SDA  (via drill 0.3)
  Top 0.178: J3.3 8.09,22.36 v8.13,22.4 | U4.42 21.86,23.07 v21.84,23.09 | v35.69,23.09 35.96,23.36 J8.3 41.65,23.36 42.04,23.75 42.04,27.56 41.49,28.11 R1.1 41.49,31.33 41.91,31.75 43.18,31.75 J14.3
  Bottom 0.178: v8.13,22.4 8.37,22.64 8.38,22.64 8.82,23.09 v21.84,23.09 22.22,23.09 22.23,23.1 22.73,23.1 22.74,23.09 v35.69,23.09
SIM_!CD!  (via drill 0.3)
  Top 0.178: U4.16 28.36,33.69 v28.26,33.78 | R8.1 37.97,35.56 v37.85,35.43
  Bottom 0.178: v28.26,33.78 28.42,33.93 36.45,33.93 | J6.5 40.26,36.45 37.85,36.45 37.21,35.81 37.21,35.43 | v37.85,35.43 37.21,35.43 | 36.45,33.93 36.42,33.91 SIM.2 | 36.45,33.93 37.21,34.69 37.21,35.43
SIM_CLK  (via drill 0.3)
  Top 0.178: U4.14 28.86,35.21 v29.21,35.56
  Bottom 0.178: J15.C3 v29.21,35.56 30.48,34.29 35.18,34.29 37.72,36.83 39.88,36.83 43.18,40.13 43.18,41.91 J6.4
SIM_IO  (via drill 0.3)
  Top 0.178: U4.12 29.36,34.69 v30.23,35.56
  Bottom 0.178: v30.23,35.56 J15.C7 35.95,35.56 37.57,37.19 39.73,37.19 42.82,40.28 42.82,44.09 J6.3
SIM_RST  (via drill 0.3)
  Top 0.178: U4.10 29.86,34.35 31.08,35.57 v31.08,38.1
  Bottom 0.178: J15.C2 v31.08,38.1 31.08,38.01 32.26,36.83 36.71,36.83 37.42,37.54 39.58,37.54 42.47,40.43 42.47,46.28 J6.2
SIM_VCC  (via drill 0.3)
  Top 0.178: U4.8 30.36,34.35 31.71,35.7 31.71,36.7 | v31.75,39.37 31.71,39.33 31.71,36.7 | R8.2 41.49,36.36 41.15,36.7 31.71,36.7
  Bottom 0.178: J15.C1 8.98,39.75 9.36,39.37 v31.75,39.37 40.91,39.37 42.11,40.57 42.11,48.46 J6.1
TX
  Top 0.178: U4.64 16.36,29.36 15.24,30.48 J2.2
USB_D+
  Top 0.178: J1.A6 22.61,5.2 22.73,5.08 23.5,5.08 23.61,5.2 J1.B6 23.61,6.85 24.36,7.6 24.36,10.11 24.88,10.62 30.18,10.62 30.61,11.05 U4.7
USB_D-
  Top 0.178: J1.A7 23.11,6.85 | U4.9 30.11,11.31 29.77,10.98 24.73,10.98 24,10.25 24,7.75 23.11,6.85 | J1.B7 22.11,6.87 22.23,6.99 22.98,6.99 23.11,6.85
V_BATT
  Top 0.559: D4.A 16.38,7.74 13.21,4.57 9.16,4.57 | 9.16,4.57 J4.2 9.16,10.14 8.89,10.41 3.81,10.41 | 9.16,4.57 9.16,2.81 J7.1 | C4.1 3.81,10.41 | U2.3 3.49,10.73 3.81,10.41
V_USB  (via drill 0.3)
  Top 0.178: 29.11,13.82 v29.08,13.84 | 3.49,15.78 C3.1
  Top 0.305: U4.13 29.11,13.82
  Top 0.457: J1.VBUS2 25.31,6.92 v25.27,6.92 | J1.VBUS1 20.41,6.88 v20.45,6.92
  Top 0.559: v20.45,6.92 20.5,6.97 21.3,6.97 22.08,7.74 D1.A | C3.1 v4.57,15.88 | D2.A 4.19,6.35 v4.76,6.92 | U2.4 3.49,15.78
  Bottom 0.305: v29.08,13.84 29.08,10.6 25.4,6.92 v25.27,6.92
  Bottom 0.457: v25.27,6.92 v20.45,6.92
  Bottom 0.559: v20.45,6.92 20.32,7.04 4.88,7.04 v4.76,6.92 4.7,6.86 4.7,15.75 v4.57,15.88
VACT_GPS_IN  (via drill 0.3)
  Top 0.178: U4.22 26.86,21.78 26.29,22.35 v26.29,26.92
  Bottom 0.178: JP2.2 26.26,26.9 v26.29,26.92
VACT_GPS_OUT  (via drill 0.3)
  Top 0.178: U4.20 27.36,22.12 27.13,22.36 27.13,26.87 v27.18,26.92
  Bottom 0.178: JP2.1 27.08,26.82 v27.18,26.92
VIN  (via drill 0.3)
  Top 0.305: U4.74 13.86,21.61 13.97,21.72 | U4.72 14.36,21.71 14.35,21.72 | U4.70 v14.86,21.72 | C17.1 35.88,13.44 U1.1 35.88,16.2 36.2,16.51 v36.83,16.51 37.47,16.51 37.78,16.2 U1.3
  Top 0.559: MEAS.4 13.08,10.16 12.57,10.67 10.54,10.67 9.38,11.83 C1.1 9.27,12.8 9.27,15.24 | 9.27,15.24 9.27,17.14 | 9.27,17.14 9.27,19.05 | C5.1 9.27,19.05 | C6.1 9.27,17.14 | C7.1 9.27,15.24 | J5.5 J5.4 J5.3 J5.2 J5.1 2.49,26.72 2.59,26.72 3.28,26.04 8.13,26.04 9.27,24.89 9.27,21.72 | 9.27,21.72 9.27,19.05 | 14.35,21.72 13.97,21.72 | 13.97,21.72 9.27,21.72 | 13.97,21.72 v14.86,21.72
  Bottom 0.178: MEAS.4 MEAS.2
  Bottom 0.305: VIN_LED.2 42.66,13.6 39.75,16.51 v36.83,16.51 36.83,19.56 34.67,21.72 v14.86,21.72
VIN1  (via drill 0.3)
  Top 0.559: MEAS.3 17.9,10.04 D4.C v21.59,10.04 D1.C | D6.C 26.66,10.04 v26.67,10.03
  Bottom 0.178: MEAS.1 MEAS.3
  Bottom 0.559: v26.67,10.03 21.61,10.03 v21.59,10.04
VIO
  Top 0.305: U4.4 31.36,21.45 31.62,21.72 31.88,21.72 | 31.88,21.72 35.56,21.72 35.98,21.3 C18.1 35.88,19.59 U1.5 | U4.2 31.86,21.7 31.88,21.72

### Text on the board
Bottom: x02
tPlace: + | -
bPlace: + | -
tDocu: N. Seidle